# EAGLE design datalogger-v10 (EAGLE 7.7.0)
DATABASE: $HOME/Documents/eagle/PARTS-DB.csv

## Sheet 1 of 2
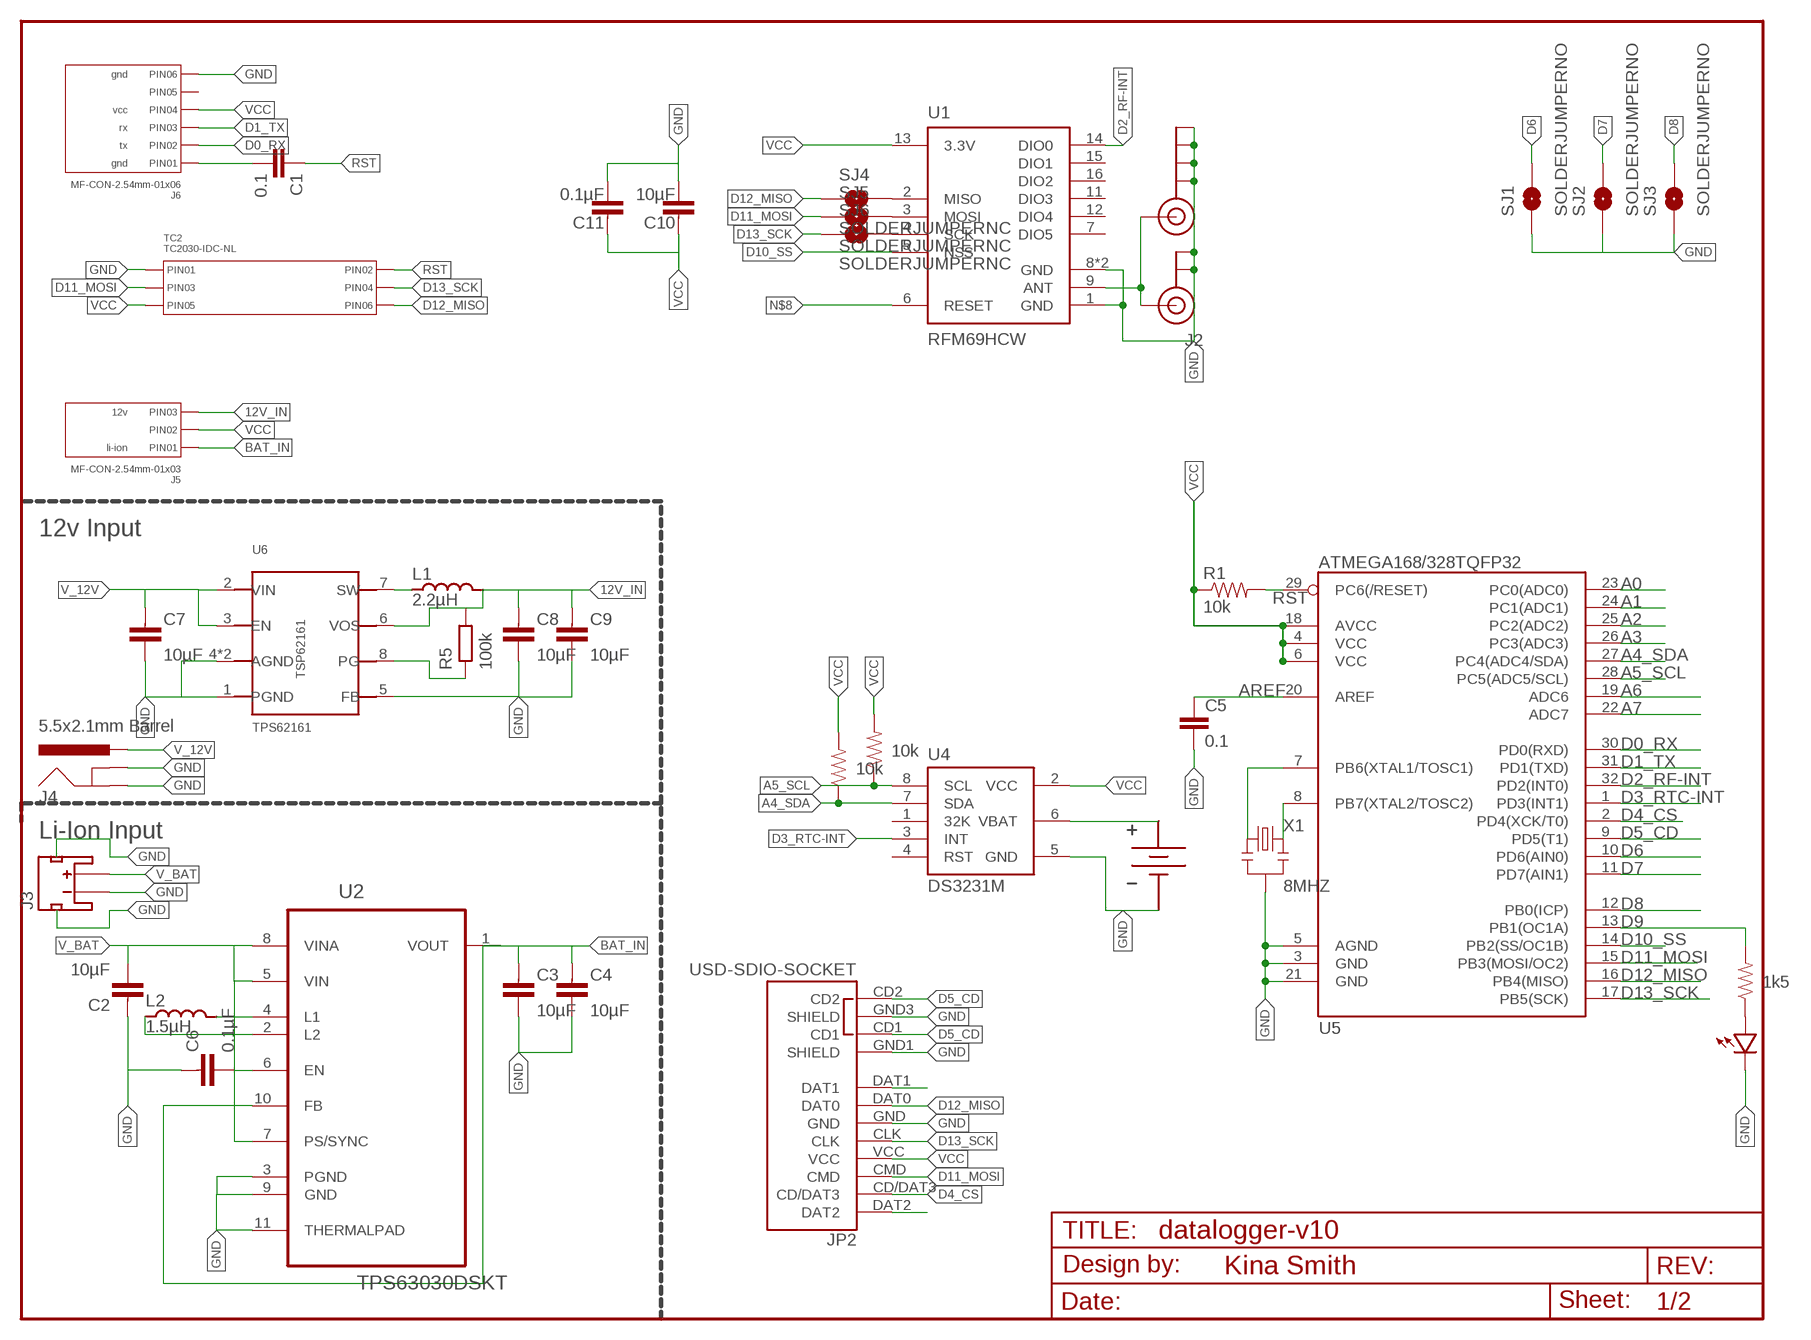
[diagram p0: schematic, sheet 1]

### Parts
C1  0.1  CAP0603-CAP  [0603-CAP]
C2  10µF  CAPACITOR0805-N  [C0805-N]
C3  10µF  CAPACITOR0805-N  [C0805-N]
C4  10µF  CAPACITOR0805-N  [C0805-N]
C5  0.1  CAP0603-CAP  [0603-CAP]
C6  0.1µF  CAPACITOR0603-N  [C0603-N]
C7  10µF  CAPACITOR0805-N  [C0805-N]
C8  10µF  CAPACITOR0805-N  [C0805-N]
C9  10µF  CAPACITOR0805-N  [C0805-N]
C10  10µF  CAPACITOR0805-N  [C0805-N]
C11  0.1µF  CAPACITOR0603-N  [C0603-N]
FRAME1  FRAME-LETTERNO_PACKAGE  [DUMMY]
J2  U.FL  [U.FL]
J3  JST_2MM_MALE  [JST-2-SMD]
J4  5.5x2.1mm Barrel  POWER_JACKSMD  [POWER_JACK_SMD]
J5  MF-CON-2.54mm-01x03  CON_01X03_PTH_2.54MM  [PTH_2.54MM_01X03]
J6  MF-CON-2.54mm-01x06  CON_01X06_PTH_2.54MM  [PTH_2.54MM_01X06]
J$1  SMA_EDGE  [SMA-EDGE]
JP2  USD-SDIO-SOCKET  [MICRO-SD-SOCKET-SDIO]
L1  2.2µH  INDUCTOR2520  [IND_2.5X2]
L2  1.5µH  INDUCTOR3030  [IND_3X3]
R1  10k  RESISTOR0603-RES  [0603-RES]
R2  1k5  RESISTOR0603-RES  [0603-RES]
R3  10k  RESISTOR0603-RES  [0603-RES]
R4  10k  RESISTOR0603-RES  [0603-RES]
R5  100k  RESISTOR0603-N  [R0603-N]
SJ1  SOLDERJUMPERNO  [SJ_2S-NO]
SJ2  SOLDERJUMPERNO  [SJ_2S-NO]
SJ3  SOLDERJUMPERNO  [SJ_2S-NO]
SJ4  SOLDERJUMPERNC  [SJ_2S]
SJ5  SOLDERJUMPERNC  [SJ_2S]
SJ6  SOLDERJUMPERNC  [SJ_2S]
TC2  TC2030-IDC-NL  CON_02X03_AVRISP_TC2030-IDC-NL  [TC2030-IDC-NL]
U1  RFM69HCW  [RFM69HCW-XXXS2]
U2  TPS63030DSKT  [SON50P260X260X80-11N]
U4  DS3231M  [SO08]
U5  ATMEGA168/328TQFP32  [TQFP32-08]
U6  TPS62161  [WSON-8]
U$1  BATTERY_HOLDER12MM  [BATTCON_12MM]
U$2  LED0603  [0603-LED]
X1  8MHZ  RESONATORSMD  [RESONATOR-SMD]

### Nets
3V3L1: L2.P$2 U2.4(L1)
3V3L2: L2.P$1 U2.2(L2)
12V_IN: C8.1 C9.1 J5.P$3(PIN3) L1.P$2 R5.2 U6.6(VOS)
A0: U5.23(PC0(ADC0))
A1: U5.24(PC1(ADC1))
A2: U5.25(PC2(ADC2))
A3: U5.26(PC3(ADC3))
A4_SDA: R4.1 U4.7(SDA) U5.27(PC4(ADC4/SDA))
A5_SCL: R3.1 U4.8(SCL) U5.28(PC5(ADC5/SCL))
A6: U5.19(ADC6)
A7: U5.22(ADC7)
ANT: J2.P$3(SIGNAL) J$1.SIG(SIGNAL) U1.9(ANT)
AREF: C5.1 U5.20(AREF)
BAT_IN: C3.1 C4.1 J5.P$1(PIN1) U2.1(VOUT) U2.10(FB)
D0_RX: J6.P$2(PIN2) U5.30(PD0(RXD))
D1_TX: J6.P$3(PIN3) U5.31(PD1(TXD))
D2_RF-INT: U1.14(DIO0) U5.32(PD2(INT0))
D3_RTC-INT: U4.3(INT) U5.1(PD3(INT1))
D4_CS: JP2.CD/DAT3 U5.2(PD4(XCK/T0))
D5_CD: JP2.CD1 JP2.CD2 U5.9(PD5(T1))
D6: SJ1.2 U5.10(PD6(AIN0))
D7: SJ2.2 U5.11(PD7(AIN1))
D8: SJ3.2 U5.12(PB0(ICP))
D9: R2.2 U5.13(PB1(OC1A))
D10_SS: U1.5(NSS) U5.14(PB2(SS/OC1B))
D11_MOSI: JP2.CMD SJ5.1 TC2.P$3(PIN3) U5.15(PB3(MOSI/OC2))
D12_MISO: JP2.DAT0 SJ4.1 TC2.P$6(PIN6) U5.16(PB4(MISO))
D13_SCK: JP2.CLK SJ6.1 TC2.P$4(PIN4) U5.17(PB5(SCK))
GND [power]: C2.1 C3.2 C4.2 C5.2 C6.1 C7.2 C8.2 C9.2 C10.2 C11.2 J2.P$1(GND) J2.P$2(GND) J3.1(-) J3.NC1(PAD1) J3.NC2(PAD2) J4.GND(GNDBREAK) J4.P$4(GND) J6.P$6(PIN6) J$1.GND@0(GND) J$1.GND@1(GND) J$1.GND@2(GND) J$1.GND@3(GND) JP2.GND JP2.GND1(SHIELD) JP2.GND3(SHIELD) SJ1.1 SJ2.1 SJ3.1 TC2.P$1(PIN1) U1.1(GND) U1.8(GND) U1.10(GND) U2.3(PGND) U2.9(GND) U2.11(THERMALPAD) U4.5(GND) U5.3(GND) U5.5(AGND) U5.21(GND) U6.1(PGND) U6.4(AGND) U6.5(FB) U6.P$9(AGND) U$1.GND U$2.MINUS X1.2
N$1: U5.7(PB6(XTAL1/TOSC1)) X1.1
N$2: R2.1 U$2.PLUS
N$3: JP2.DAT2
N$4: C1.2 J6.P$1(PIN1)
N$7: SJ4.2 U1.2(MISO)
N$8: U1.6(RESET)
N$9: SJ5.2 U1.3(MOSI)
N$10: U4.6(VBAT) U$1.PWR@1(VBAT) U$1.PWR@2(VBAT)
N$13: JP2.DAT1
N$15: SJ6.2 U1.4(SCK)
N$18: R5.1 U6.8(PG)
N$21: U5.8(PB7(XTAL2/TOSC2)) X1.3
RST: C1.1 R1.2 TC2.P$2(PIN2) U5.29(PC6(/RESET))
SW: L1.P$1 U6.7(SW)
V_12V: C7.1 J4.VIN0(PWR) U6.2(VIN) U6.3(EN)
V_BAT: C2.2 C6.2 J3.2(+) U2.5(VIN) U2.6(EN) U2.7(PS/SYNC) U2.8(VINA)
VCC: C10.1 C11.1 J5.P$2(PIN2) J6.P$4(PIN4) JP2.VCC R1.1 R3.2 R4.2 TC2.P$5(PIN5) U1.13(3.3V) U4.2(VCC) U5.4(VCC) U5.6(VCC) U5.18(AVCC)
Unconnected: J6.P$5(PIN5) U1.7(DIO5) U1.11(DIO3) U1.12(DIO4) U1.15(DIO1) U1.16(DIO2) U4.1(32K) U4.4(RST)

### Notes on the sheet
- 12v Input
- Li-Ion Input

## Sheet 2 of 2
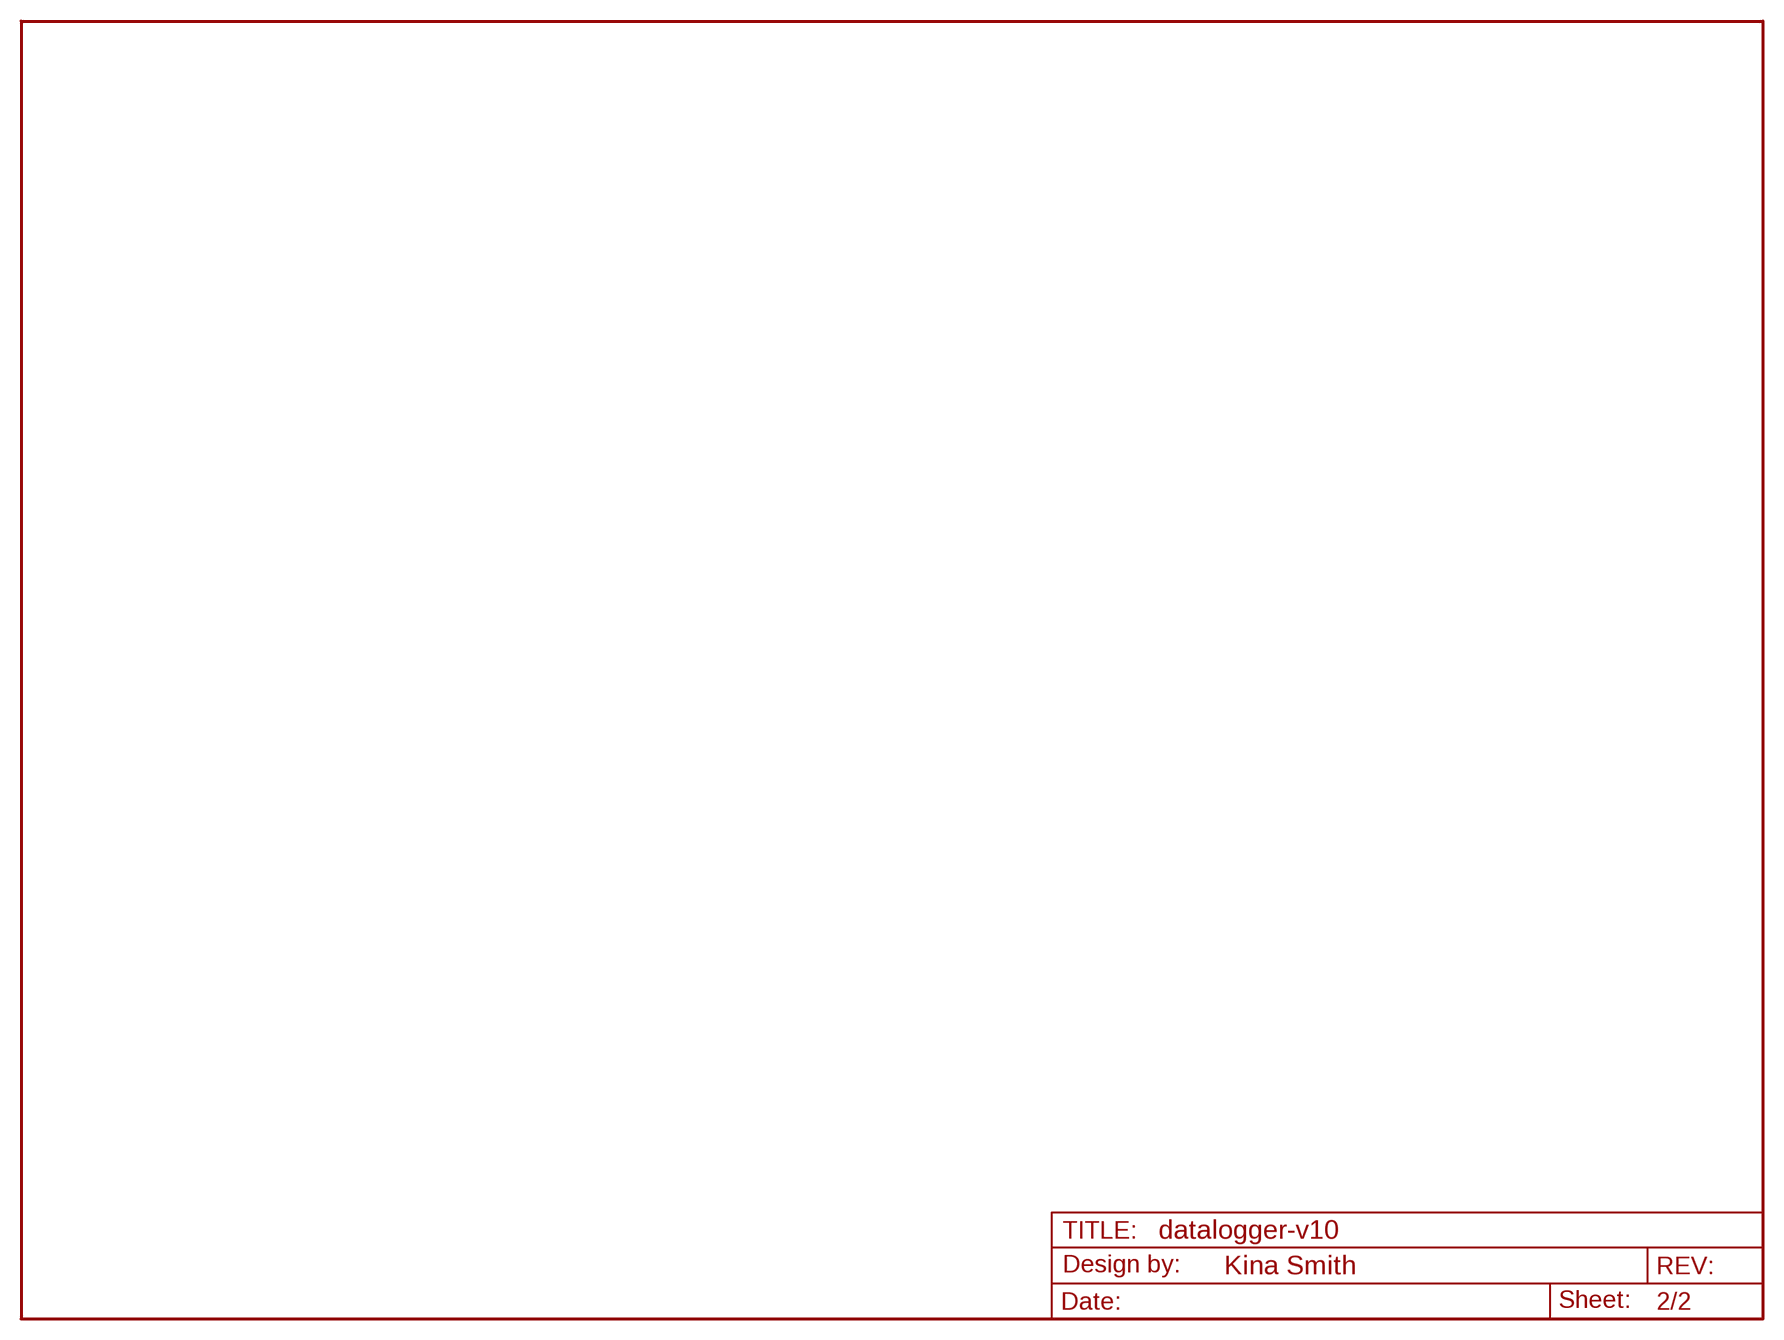
[diagram p1: schematic, sheet 2]

### Parts
FRAME3  FRAME-LETTERNO_PACKAGE  [DUMMY]

## Library data of the parts
C1 C5 = LowPowerLab:CAP: Capacitor Standard 0603 ceramic capacitor, and 0.1" leaded capacitor.
C2-C4 C6-C9 = passives-7351:CAPACITOR
C10 C11 = Passives:CAPACITOR
FRAME1 FRAME3 = _my-parts:FRAME-LETTER: Schematic Frame Standard 8.5x11 US Letter frame; DESIGNER: Nobody; VERSION: v01
J2 = SparkFun-Connectors:U.FL: SMD antenna connector- WRL-09144; PROD_ID: CONN-09193
J3 = SparkFun-Connectors:JST_2MM_MALE: Mates to single-cell LiPo batteries. CONN-11443 Now with smashable polarity marks!; BTM_NEG: -; BTM_POS: +; PROD_ID: CONN-11443; TOP_NEG: -; TOP_POS: +
J4 = SparkFun-Connectors:POWER_JACK: Power Jack This is the standard 5.5mm barrel jack for power. The PTH is the most common, proven, reliable, footprint. The Slot footprint only works if the mill layer is transmitted to the PCB fab house so be warned. Mating wall wart : TOL-00298 (and others); PROD_ID: CONN-08106; SF_ID: PRT-12748
J5 = My_Connectors:CON_01X03: Library: MF_Connectors Description: Header Connector with 03 Positions and 01 Rows. Use the LABEL Attribute to label the pin on the schematic and PCB. You can remove the attributes on the PCB by using the SMASH function on the part and then deleting the text.; HOUSEPART: YES; LABEL01: li-ion; LABEL03: 12v; MPN: MF-CON-2.54mm-01x03; POPULATE: 1; URL: https://factory.macrofab.com/part/MF-CON-2.54mm-01x03
J6 = My_Connectors:CON_01X06: Library: MF_Connectors Description: Header Connector with 6 Positions and 01 Rows. Use the LABEL Attribute to label the pin on the schematic and PCB. You can remove the attributes on the PCB by using the SMASH function on the part and then deleting the text.; HOUSEPART: YES; LABEL01: gnd; LABEL02: tx; LABEL03: rx; LABEL04: vcc; LABEL06: gnd; MPN: MF-CON-2.54mm-01x06; POPULATE: 1; URL: https://factory.macrofab.com/part/MF-CON-2.54mm-01x06
J$1 = SparkFun-Connectors:SMA_EDGE: SMA Antenna Connector End launch SMA connector. The paste layer has been removed so that the connector can be hand soldered onto the board after reflow.
JP2 = My_Connectors:USD-SDIO-SOCKET: microSD Socket Push-push type uSD socket with full SDIO signal mapping. Spark Fun Electronics SKU : PRT-00127. tDoc lines correctly indicate media card edge positions when inserting (unlocked, locked, depressed). NOTE: CD1 and CD2 are connected internally, and short to ground when card is removed.; PROD_ID: CONN-07820
L1 L2 = Passives:INDUCTOR
R1-R4 = LowPowerLab:RESISTOR: Resistor Basic schematic elements and footprints for 0603, 1206, and PTH resistors.
R5 = passives-7351:RESISTOR
SJ1-SJ6 = SparkFun-Retired:SOLDERJUMPER: Solder Jumper Standard SMD solder jumper. Used to automate production. Two varients : Normally Open and Normally Closed are the same, but have different paste layers. NC will have a large amount of paste and should jumper during reflow.
TC2 = My_Connectors:CON_02X03: Library: MF_Connectors Description: Header Connector with 6 Positions and 02 Rows. Use the LABEL Attribute to label the pin on the schematic and PCB. You can remove the attributes on the PCB by using the SMASH function on the part and then deleting the text.; HOUSEPART: NO; MPN: TC2030-IDC-NL; POPULATE: 0; URL: http://www.tag-connect.com/AVRISP
U1 = SparkFun-RF:RFM69H; PROD_ID: IC-11997, IC-12053
U2 = My_IC_Power:TPS63030DSKT: HIGH EFFICIENCY SINGLE INDUCTOR BUCK-BOOST CONVERTER WITH 1-A SWITCHES; MPN: TPS63030DSKT; OC_FARNELL: 1686303; OC_NEWARK: 19P7478; PACKAGE: SON-10; SUPPLIER: Texas Instruments
U4 = My_IC_Digital:DS3231M: The DS3231M is a low-cost, extremely accurate, I2C realtime clock (RTC). Datasheet <https://datasheets.maximintegrated.com/en/ds/DS3231M.pdf>
U5 = My_IC_Digital:ATMEGA168/328: Atmel 32-pin 8-bit micro, 16k flash.
U6 = My_IC_Power:TPS62161; PARTNO: TPS62161DSGR
U$1 = Custom_Parts:BATTERY_HOLDER
U$2 = LowPowerLab:LED
X1 = SparkFun:RESONATOR: Resonator Small SMD resonator. This is the itty bitty 10/20MHz resonators with built in caps. CSTCE10M0G55 and CSTCE20M0V53. Footprint has been reviewed closely but hasn't been tested yet.

## Net classes
1 power: width 0.381 mm, clearance 0.254 mm

## Board
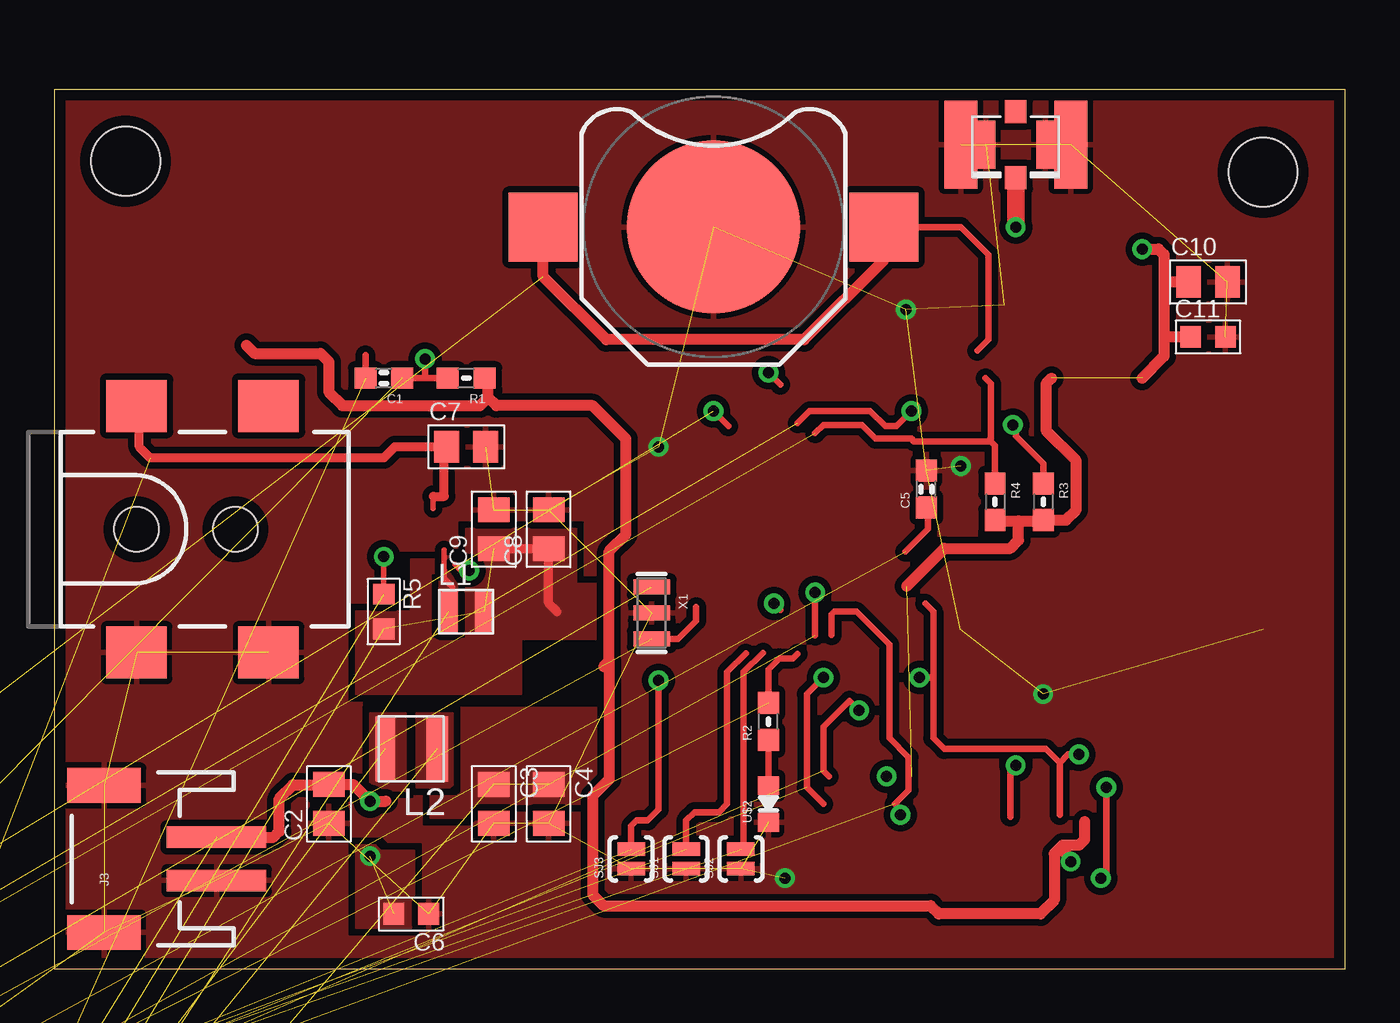
[diagram p2: board, top side]
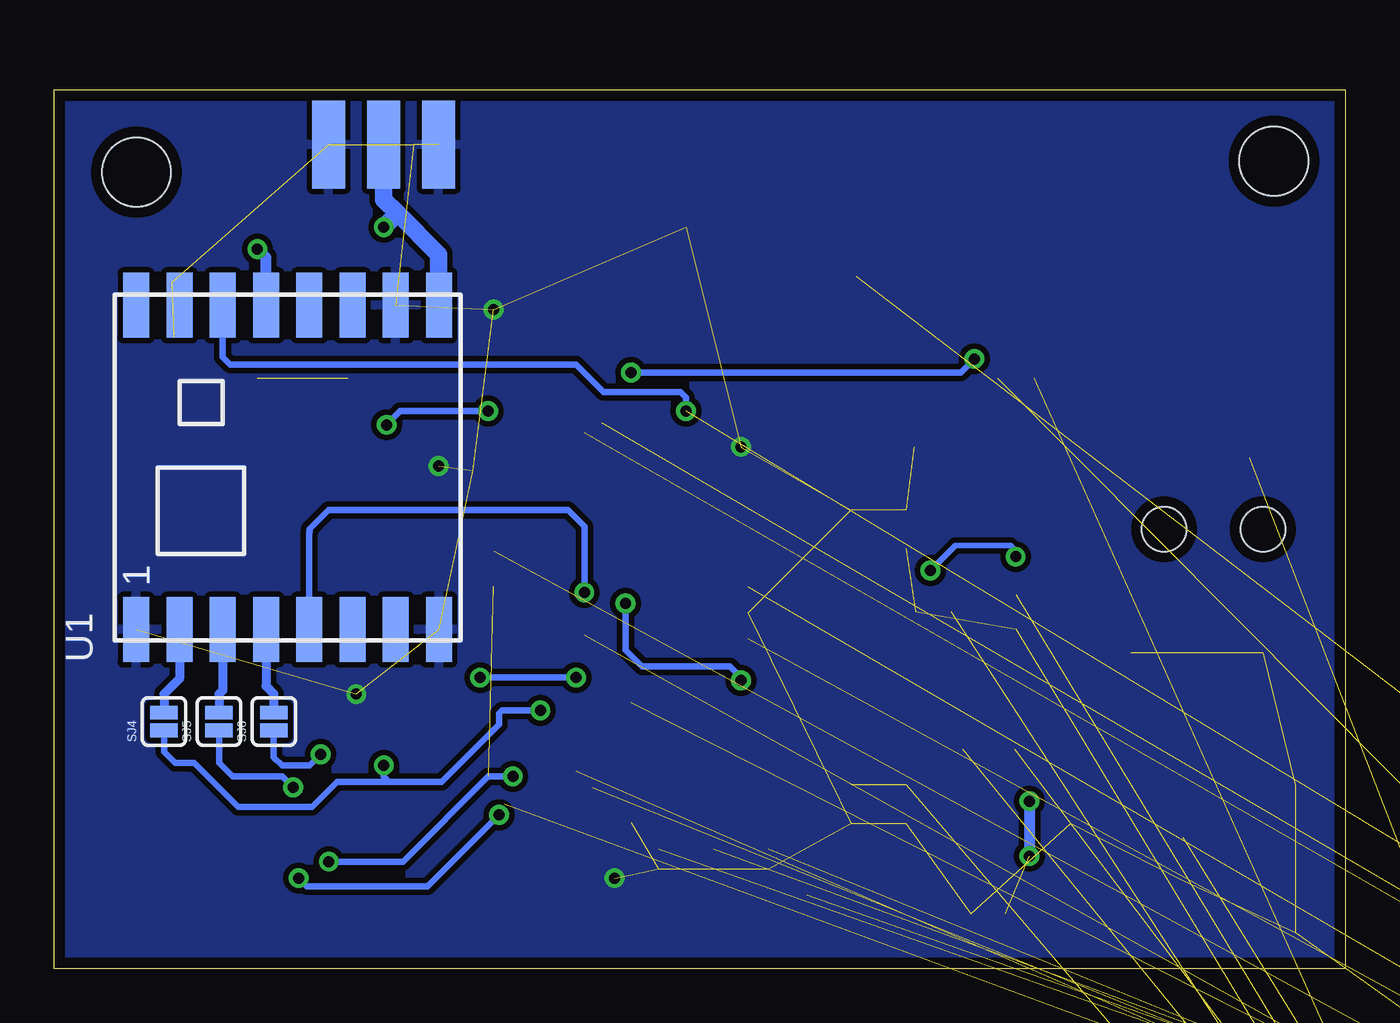
[diagram p3: board, bottom side, seen from below]

Size 59.69 x 40.64 mm. Coordinates in mm from the lower left corner, seen from the top.
Outline: 0,0 59.69,0 59.69,40.64 0,40.64 0,0
Copper layers (1*16): Top 0.0178mm / dielectric 59mil / Bottom 0.0178mm
Design rules "SSC-EAGLE-2Lyr_v1.0.0.3": minimum track width 6mil, minimum drill 14mil, track to track 6mil, track to pad 6mil, pad to pad 6mil, via to via 6mil, smd to smd 6mil, copper to edge 20mil, drill to drill 16mil, minimum pad ring 8mil, minimum via ring 8mil, stop-mask expansion 3mil, vias tented up to drill 0mil, thermal gap 10mil
Holes 3.17 mm at 3.3,37.34 55.88,36.83

### Footprints (pad centres in the part's own frame; a part is rotated, then mirrored left to right if it is on the bottom)
0603-CAP = smd 1.016 x 0.965: 1 -0.85,0; 2 0.85,0
C0805-N = smd 1.15 x 1.45: 1 -0.9,0; 2 0.9,0
C0603-N = smd 0.95 x 1: 1 -0.8,0; 2 0.8,0
U.FL = smd 2.2 x 0.85: P$1 0,1.375; P$2 0,-1.375 | smd 1.05 x 1: P$3 1.525,0; P$4 -1.525,0
JST-2-SMD = smd 1 x 4.6: 1 -1,-3.7; 2 1,-3.7 | smd 1.6 x 3.4: NC1 -3.4,1.5; NC2 3.4,1.5
POWER_JACK_SMD = smd 2.8 x 2.4: GND 0,-5.7; P$4 6.1,-5.7; VIN0 0,5.7; VIN1 6.1,5.7 | hole 2.032: 0,0; 4.572,0
PTH_2.54MM_01X03 = drill 1: P$1 -2.54,0; P$2 0,0; P$3 2.54,0
PTH_2.54MM_01X06 = drill 1: P$1 -6.35,0; P$2 -3.81,0; P$3 -1.27,0; P$4 1.27,0; P$5 3.81,0; P$6 6.35,0
SMA-EDGE = smd 1.524 x 4.064: GND@0 0,0; GND@1 5.08,0; SIG 2.54,0 | smd 1.524 x 4.064 bottom: GND@2 0,0; GND@3 5.08,0
MICRO-SD-SOCKET-SDIO = smd 1.8 x 1.4: CD1 11.92,0.4; CD2 6.22,0.4 | smd 0.8 x 1.5: CD/DAT3 6.13,10.3; CLK 9.43,10.7; CMD 7.23,10.7; DAT0 11.63,10.7; DAT1 12.73,10.7; DAT2 5.03,10.7; GND 10.53,10.9; VCC 8.33,10.9 | smd 1.4 x 1.9: GND1 0.37,14.55; GND3 13.52,13.55
IND_2.5X2 = smd 0.85 x 2: P$1 -0.825,0; P$2 0.825,0
IND_3X3 = smd 1 x 3: P$1 -1.2,0 | smd 0.9 x 3: P$2 1.2,0
0603-RES = smd 1.016 x 0.965: 1 -0.85,0; 2 0.85,0
R0603-N = smd 0.95 x 1: 1 -0.8,0; 2 0.8,0
SJ_2S-NO = smd 0.635 x 1.27: 1 -0.45,0; 2 0.45,0
SJ_2S = smd 0.635 x 1.27: 1 -0.412,0; 2 0.412,0
TC2030-IDC-NL = smd 0.787 x 0.787: P$1 -1.27,-0.635; P$2 -1.27,0.635; P$3 0,-0.635; P$4 0,0.635; P$5 1.27,-0.635; P$6 1.27,0.635 | hole 0.991: 2.54,1.016; 2.54,-1.016; -2.54,0
RFM69HCW-XXXS2 = smd 3 x 1.2: 1 -7.5,7; 2 -7.5,5; 3 -7.5,3; 4 -7.5,1; 5 -7.5,-1; 6 -7.5,-3; 7 -7.5,-5; 8 -7.5,-7; 9 7.5,-7; 10 7.5,-5; 11 7.5,-3; 12 7.5,-1; 13 7.5,1; 14 7.5,3; 15 7.5,5; 16 7.5,7
SON50P260X260X80-11N = smd 0.762 x 0.305: 1 -1.219,0.991; 2 -1.219,0.508; 3 -1.219,0; 4 -1.219,-0.508; 5 -1.219,-0.991; 6 1.219,-0.991; 7 1.219,-0.508; 8 1.219,0; 9 1.219,0.508; 10 1.219,0.991 | smd 1.295 x 2.108: 11 0,0
SO08 = smd 0.66 x 2.032: 1 -1.905,-3.073; 2 -0.635,-3.073; 3 0.635,-3.073; 4 1.905,-3.073; 5 1.905,3.073; 6 0.635,3.073; 7 -0.635,3.073; 8 -1.905,3.073
TQFP32-08 = smd 1.27 x 0.533: 1 -4.293,2.8; 2 -4.293,2; 3 -4.293,1.2; 4 -4.293,0.4; 5 -4.293,-0.4; 6 -4.293,-1.2; 7 -4.293,-2; 8 -4.293,-2.8; 17 4.293,-2.8; 18 4.293,-2; 19 4.293,-1.2; 20 4.293,-0.4; 21 4.293,0.4; 22 4.293,1.2; 23 4.293,2; 24 4.293,2.8 | smd 0.533 x 1.27: 9 -2.8,-4.293; 10 -2,-4.293; 11 -1.2,-4.293; 12 -0.4,-4.293; 13 0.4,-4.293; 14 1.2,-4.293; 15 2,-4.293; 16 2.8,-4.293; 25 2.8,4.293; 26 2,4.293; 27 1.2,4.293; 28 0.4,4.293; 29 -0.4,4.293; 30 -1.2,4.293; 31 -2,4.293; 32 -2.8,4.293
WSON-8 = smd 0.28 x 0.5: 1 -0.75,-0.95; 2 -0.25,-0.95; 3 0.25,-0.95; 4 0.75,-0.95; 5 0.75,0.95; 6 0.25,0.95; 7 -0.25,0.95; 8 -0.75,0.95 | smd 1.6 x 0.9: P$9 0,0
BATTCON_12MM = smd 8 x 8: GND 0,0 | smd 3.175 x 3.175: PWR@1 -7.874,0; PWR@2 7.874,0
0603-LED = smd 0.864 x 0.965: MINUS -0.85,0; PLUS 0.85,0
RESONATOR-SMD = smd 0.7 x 1.7: 1 -1.2,0; 2 0,0; 3 1.2,0

### Placement (x,y rotation side)
C1  15.24,27.3 180 top
C2  12.7,7.62 90 top
C3  20.32,7.62 270 top
C4  22.86,7.62 270 top
C5  40.32,22.18 90 top
C6  16.51,2.54 180 top
C7  19.05,24.13 0 top
C8  22.86,20.32 90 top
C9  20.32,20.32 90 top
C10  53.34,31.75 0 top
C11  53.34,29.21 0 top
FRAME1  0,-1.27 0 top
FRAME3  1.27,-1.27 0 top
J2  44.45,38.1 270 top
J3  3.81,5.08 90 top
J4  3.81,20.32 0 top
J5  -30.48,-63.5 0 top  (outside the outline)
J6  -26.67,-78.74 0 top  (outside the outline)
J$1  46.99,38.1 0 bottom
JP2  -27.94,-36.83 0 top  (outside the outline)
L1  19.05,16.51 0 top
L2  16.51,10.16 180 top
R1  19.05,27.3 180 top
R2  33.02,11.43 90 top
R3  45.72,21.59 270 top
R4  43.5,21.59 270 top
R5  15.24,16.51 270 top
SJ1  29.21,5.08 90 top
SJ2  31.75,5.08 90 top
SJ3  26.67,5.08 90 top
SJ4  54.61,11.43 90 bottom
SJ5  52.07,11.43 90 bottom
SJ6  49.53,11.43 90 bottom
TC2  -34.29,-43.18 0 top  (outside the outline)
U1  48.9,23.18 90 bottom
U2  -24.13,-43.18 0 top  (outside the outline)
U4  -24.13,-6.35 0 top  (outside the outline)
U5  -12.7,-6.35 0 top  (outside the outline)
U6  -25.4,-52.07 0 top  (outside the outline)
U$1  30.48,34.29 0 top
U$2  33.02,7.62 90 top
X1  27.62,16.45 270 top

### Tracks (layer width: path | path; a pad name or v marks a point on that pad's centre or on a via)
3V3L1  (1 unrouted)
  pour Top (isolate 0.305, no thermals): 16.26,8.26 16.26,11.81 14.61,11.81 14.61,8.64 14.99,8.26
3V3L2  (1 unrouted)
  pour Top (isolate 0.305, no thermals): 16.76,8.38 16.76,11.81 18.41,11.81 18.41,8.51 18.29,8.38
12V_IN  (4 unrouted)
  Top 0.406: C9.1 C8.1 22.86,16.89 23.24,16.51
  pour Top (isolate 0.305, no thermals): 17.78,18.92 16.51,18.92 16.51,16.51 13.97,16.51 13.97,12.7 21.59,12.7 21.59,15.24 25.15,15.24 25.15,17.78 24.13,17.78 24.13,20.32 19.05,20.32 19.05,15.24 17.4,15.24 17.4,17.78 17.4,18.29 17.78,18.29 17.78,18.8
A4_SDA  (2 unrouted)
  Top 0.305: 35.17,24.76 35.56,25.15 37.34,25.15 37.97,24.51 39.62,24.51 39.75,24.38 43.18,24.38 | 43.18,24.38 43.31,24.38 43.5,24.19 R4.1 | 43.05,27.3 43.31,27.05 43.31,24.51 43.18,24.38
A5_SCL  (via drill 0.51)  (2 unrouted)
  Top 0.305: 34.37,25.23 34.92,25.78 37.72,25.78 38.42,25.08 38.92,25.08 v39.62,25.78 39.88,26.04 | R3.1 45.72,23.37 44.45,24.64 44.45,25.02 v44.32,25.15
  Bottom 0.305: v39.62,25.78 43.69,25.78 v44.32,25.15
ANT  (via drill 0.51)
  Top 0.813: J2.P$3 v44.45,34.29
  Bottom 0.813: J$1.SIG 44.45,35.56 43.81,34.92 | 43.81,34.92 41.91,33.02 41.91,30.69 U1.9 | v44.45,34.29 43.81,34.92
AREF  (1 unrouted)
  Top 0.305: 39.35,19.29 40.39,20.32 40.39,21.26 C5.1
BAT_IN  (4 unrouted)
  Top 0.254: C3.1
  pour Top (isolate 0.305, rank 2, no thermals): 17.4,6.99 17.4,8.38 18.29,8.38 18.54,8.51 18.54,12.06 25.15,12.06 25.15,9.02 24.38,8.26 24.38,7.62 19.56,7.62 18.92,6.99
D0_RX  (1 unrouted)
D1_TX  (1 unrouted)
D2_RF-INT  (via drill 0.51)  (1 unrouted)
  Top 0.305: 31.17,25.09 v30.48,25.78
  Bottom 0.305: U1.14 51.9,28.27 51.56,27.94 35.56,27.94 34.29,26.67 30.73,26.67 30.48,26.42 v30.48,25.78
D3_RTC-INT  (1 unrouted)
D4_CS  (1 unrouted)
D5_CD  (2 unrouted)
D6  (1 unrouted)
  Top 0.305: 31.97,14.57 31.11,13.72 31.11,7.62 30.73,7.24 29.59,7.24 29.21,6.86 SJ1.2
D7  (1 unrouted)
  Top 0.305: 32.77,14.61 31.88,13.72 31.88,5.66 SJ2.2
D8  (via drill 0.51)  (1 unrouted)
  Top 0.305: 33.57,16.59 v33.27,16.89 | v27.94,13.34 27.94,7.37 27.43,6.86 26.92,6.86 26.67,6.6 SJ3.2
  Bottom 0.305: v27.94,13.34 27.94,13.46 28.45,13.97 32.51,13.97 33.27,14.73 v33.27,16.89
D9  (1 unrouted)
  Top 0.305: R2.2 33.02,13.84 33.53,14.35 34.16,14.35 34.37,14.56
D10_SS  (via drill 0.51)  (1 unrouted)
  Top 0.305: v35.18,17.4 35.18,15.4
  Bottom 0.305: U1.5 47.9,20.18 47.88,20.19 47.88,20.32 46.99,21.21 35.94,21.21 35.18,20.45 v35.18,17.4
D11_MOSI  (via drill 0.51)  (3 unrouted)
  Top 0.305: 48.64,7.09 v48.64,8.38 48.64,4.45 v48.39,4.19 | 35.94,15.42 35.94,16.38 36.07,16.51 37.08,16.51 38.61,14.99 38.61,10.67 39.5,9.78 39.5,8.26 38.86,7.62 39.12,7.37 v39.12,7.11
  Bottom 0.305: SJ5.1 52.07,9.53 51.44,8.89 49.15,8.89 v48.64,8.38 | v39.12,7.11 42.42,3.81 48.01,3.81 v48.39,4.19
D12_MISO  (via drill 0.51)  (3 unrouted)
  Top 0.305: 35.81,8.89 35.56,9.14 35.56,11.18 36.77,12.39 v37.21,11.95 v37.21,11.94 | 44.2,7.03 44.2,9.14 v44.45,9.4
  Bottom 0.305: SJ4.1 54.61,10.03 54.1,9.53 53.21,9.53 51.18,7.49 47.75,7.49 46.61,8.64 44.2,8.64 | 44.2,8.64 41.78,8.64 39.12,11.3 39.12,11.81 38.99,11.94 v37.21,11.94 | v44.45,9.4 44.45,8.89 44.2,8.64
D13_SCK  (via drill 0.51)  (3 unrouted)
  Top 0.305: 35.56,7.62 34.8,8.38 34.8,12.7 v35.56,13.46 | 46.48,7.11 46.48,9.53 | 46.48,9.53 45.85,10.16 41.15,10.16 40.64,10.67 40.64,13.46 | v47.37,9.91 46.86,9.91 46.48,9.53 | 40.27,16.89 40.64,16.51 40.64,13.46 | v40.01,13.46 40.64,13.46
  Bottom 0.305: SJ6.1 49.53,9.78 49.15,9.4 47.88,9.4 v47.37,9.91 | v35.56,13.46 v40.01,13.46
GND  (via drill 0.51)  (50 unrouted)
  other vias: 33.78,4.19 45.72,12.7 39.37,30.48 41.91,23.24 27.94,24.13
  pour Bottom: 0,0 59.69,0 59.69,40.64 0,40.64
  pour Top (isolate 0.305, rank 6): 0,0 59.69,0 59.69,40.64 0,40.64
N$1  (1 unrouted)
  Top 0.305: 27.66,17.68 X1.1
N$2
  Top 0.305: U$2.PLUS R2.1
N$4  (1 unrouted)
  Top 0.305: C1.2 14.39,28.36
N$6  (via drill 0.51)
  other vias: 44.45,34.29
N$7
  Bottom 0.406: U1.2 53.9,13.41 54.61,12.7 SJ4.2
N$9
  Bottom 0.406: U1.3 51.9,12.88 52.07,12.7 SJ5.2
N$10  (1 unrouted)
  Top 0.305: U$1.PWR@2 41.91,34.29 43.18,33.02 43.18,29.08 42.67,28.57
  Top 0.508: U$1.PWR@2 38.35,32.77 34.67,29.08 25.53,29.08 22.61,32 U$1.PWR@1
N$15
  Bottom 0.406: U1.4 49.9,13.06 49.53,12.7 SJ6.2
N$18  (via drill 0.51)  (1 unrouted)
  Top 0.254: v15.24,19.05 R5.1 | 18.53,18.68 18.8,18.41 v19.18,18.41
  Bottom 0.254: v15.24,19.05 15.24,19.3 15.49,19.56 18.03,19.56 v19.18,18.41
N$21  (1 unrouted)
  Top 0.254: 28.2,15.25 X1.3
  Top 0.305: 29.68,16.73 29.68,16.09 28.83,15.24 28.21,15.24 28.2,15.25
RST  (via drill 0.51)  (2 unrouted)
  Top 0.305: 33.57,27.01 v33.02,27.56 | v17.14,28.19 17.14,27.3 | 17.14,27.3 C1.1 | R1.2 17.14,27.3
  Bottom 0.305: v33.02,27.56 17.78,27.56 v17.14,28.19
SW  (1 unrouted)
  Top 0.254: 18.03,19.37 18.03,18.03 18.41,17.65 18.41,16.7 L1.P$1
  pour Top (isolate 0.305, rank 2, no thermals): 17.78,19.05 17.78,17.78 17.4,17.78 17.4,15.24 19.05,15.24 19.05,17.78 18.29,18.54 18.29,19.05
V_12V  (2 unrouted)
  Top 0.254: 17.53,21.84 17.53,21.27
  Top 0.406: J4.VIN0 3.94,25.89 3.94,24.13 4.45,23.62 15.24,23.62 15.75,24.13 C7.1 18.03,24.01 18.03,21.84 17.53,21.84
V_BAT  (via drill 0.51)  (5 unrouted)
  Top 0.508: J3.2 10.14,6.08 10.41,6.35 10.41,7.87 11.05,8.51 C2.2 13.83,8.52 v14.61,7.75 15.34,7.75
  Bottom 0.508: v14.61,7.75 v14.61,5.21
  pour Top (isolate 0.305, rank 2, no thermals): 16.64,5.46 15.11,5.46 14.86,5.71 13.97,5.71 13.97,1.91 16.51,1.91 16.51,3.3 16.64,3.43
VCC  (via drill 0.51)  (10 unrouted)
  Top 0.508: v50.29,33.27 51.05,33.27 51.31,33.02 51.31,31.75 | 51.31,31.75 51.31,29.21 | 51.31,29.21 51.31,28.32 50.29,27.3 | R4.2 43.54,20.7 44.58,20.7 | 8.89,28.83 9.27,28.45 12.32,28.45 12.7,28.07 12.7,26.67 13.34,26.04 19.68,26.04 20.07,26.42 | 20.07,26.42 20.07,27.14 | 20.07,27.14 R1.1 | 20.07,27.3 20.07,27.14 | 25.65,14.22 25.65,19.3 26.43,20.09 26.43,24.49 24.89,26.04 20.45,26.04 20.07,26.42 | 44.58,20.7 45.68,20.7 R3.2 46.77,20.74 47.24,21.21 47.24,23.5 45.85,24.89 45.85,27.05 46.1,27.3 | 25.4,13.97 25.65,14.22 | 25.65,14.22 25.65,8.76 24.89,8 24.89,3.43 25.4,2.92 40.51,2.92 40.89,2.54 45.59,2.54 46.23,3.17 46.23,5.33 46.48,5.59 | C10.1 51.31,31.75 | C11.1 51.31,29.21 | 39.4,17.68 41.15,19.43 44.2,19.43 44.58,19.81 44.58,20.7 | 47.62,6.8 47.62,5.97 47.37,5.71 46.61,5.71 46.48,5.59 | v46.99,4.95 46.99,5.08 46.48,5.59
  Bottom 0.305: v38.48,8.89 39.62,8.89 43.56,4.95 v46.99,4.95
  Bottom 0.508: U1.13 49.9,32.88 v50.29,33.27